# Altium schematic sheet PF3_MS.SchDoc
size 279 x 177 mm
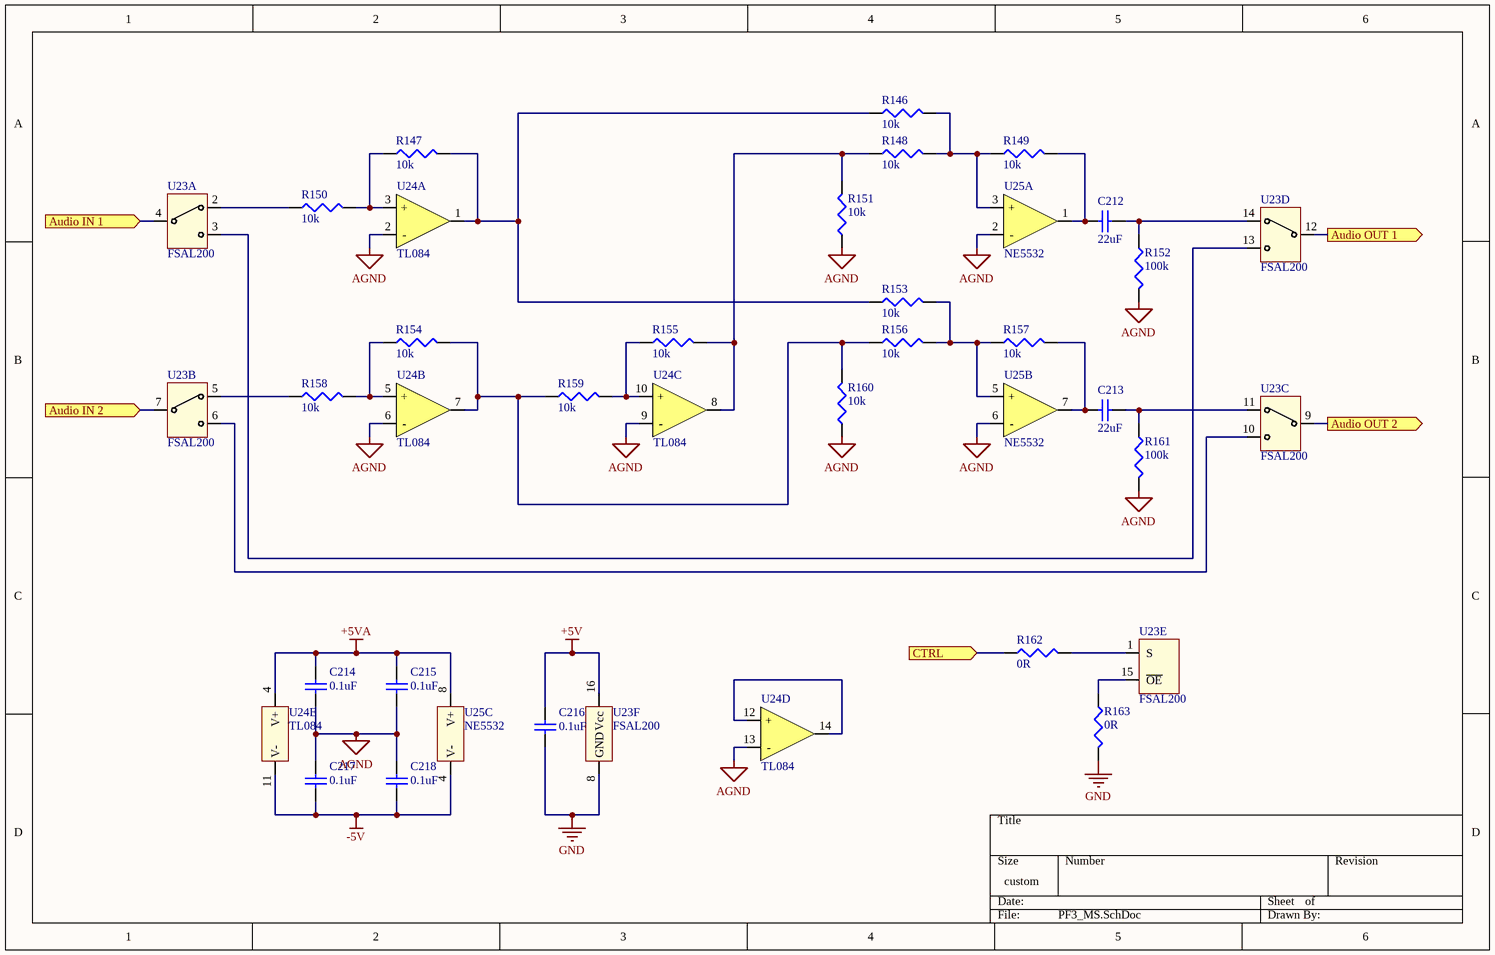
[diagram p0: PF3_MS.SchDoc]

## Parts
C212  22uF  [CAPC1608X08]
C213  22uF  [CAPC1608X08]
C214  0.1uF  [CAPC1608X08]
C215  0.1uF  [CAPC1608X08]
C216  0.1uF  [CAPC1608X08]
C217  0.1uF  [CAPC1608X08]
C218  0.1uF  [CAPC1608X08]
R146  10k  [RESC1608X05]
R147  10k  [RESC1608X05]
R148  10k  [RESC1608X05]
R149  10k  [RESC1608X05]
R150  10k  [RESC1608X05]
R151  10k  [RESC1608X05]
R152  100k  [RESC1608X05]
R153  10k  [RESC1608X05]
R154  10k  [RESC1608X05]
R155  10k  [RESC1608X05]
R156  10k  [RESC1608X05]
R157  10k  [RESC1608X05]
R158  10k  [RESC1608X05]
R159  10k  [RESC1608X05]
R160  10k  [RESC1608X05]
R161  100k  [RESC1608X05]
R162  0R  [RESC1608X05]
R163  0R  [RESC1608X05]
U23  FSAL200  [TSOP65P730X110-16N]  (parts A,B,C,D,E,F of 6)
U24  TL084  [D14-M]  (parts A,B,C,D,E of 5)
U25  NE5532  [D8-M]  (parts A,B,C of 3)

## Ports
Audio IN 1 (in), Audio IN 2 (in), Audio OUT 1 (out), Audio OUT 2 (out), CTRL (in)

## Nets
+5V: C216.1 U23.16(Vcc)
+5VA: C214.1 C215.1 U24.4(V+) U25.8(V+)
-5V: C217.2 C218.2 U24.11(V-) U25.4(V-)
AGND: C214.2 C215.2 C217.1 C218.1 R151.1 R152.2 R160.1 R161.2 U24.2(-) U24.6(-) U24.9(-) U24.13(-) U25.2(-) U25.6(-)
GND: C216.2 R163.2 U23.8(GND)
Audio IN 1: U23.4(A) ; port Audio IN 1
Audio IN 2: U23.7(A) ; port Audio IN 2
Audio OUT 1: U23.12(A) ; port Audio OUT 1
Audio OUT 2: U23.9(A) ; port Audio OUT 2
CTRL: R162.1 ; port CTRL
NetC212_1: C212.1 R152.1 U23.14(B1)
NetC212_2: C212.2 R149.2 U25.1(OUT)
NetC213_1: C213.1 R161.1 U23.11(B1)
NetC213_2: C213.2 R157.2 U25.7(OUT)
NetR146_1: R146.1 R147.2 R153.1 U24.1(OUT)
NetR146_2: R146.2 R148.2 R149.1 U25.3(+)
NetR147_1: R147.1 R150.2 U24.3(+)
NetR148_1: R148.1 R151.2 R155.2 U24.8(OUT)
NetR150_1: R150.1 U23.2(B1)
NetR153_2: R153.2 R156.2 R157.1 U25.5(+)
NetR154_1: R154.1 R158.2 U24.5(+)
NetR154_2: R154.2 R156.1 R159.1 R160.2 U24.7(OUT)
NetR155_1: R155.1 R159.2 U24.10(+)
NetR158_1: R158.1 U23.5(B1)
NetR162_2: R162.2 U23.1(S)
NetR163_1: R163.1 U23.15(~{OE})
NetU23_3: U23.3(B2) U23.13(B2)
NetU23_6: U23.6(B2) U23.10(B2)
NetU24_12: U24.12(+) U24.14(OUT)

## Library data of the parts
C212 C213 = Cap Semi: Capacitor (Semiconductor SIM Model); Fabricant: MURATA; Fournisseur: Farnell; RefFabricant: GRM188R60J226MEA0D; RefFournisseur: 2666490; Value: 22uF; Case: 0603 [1608 Metric]; DataSheet: http://www.farnell.com/datasheets/1955681.pdf
C214-C218 = Cap Semi: Capacitor (Semiconductor SIM Model); Fabricant: MURATA; Fournisseur: Farnell; RefFabricant: GRM188F51E104ZA01D; RefFournisseur: 2821272; Value: 0.1uF; Case: 0603 [1608 Metric]; DataSheet: http://www.farnell.com/datasheets/2048672.pdf
R146-R151 R153-R160 = Res3: Resistor; Fabricant: TE CONNECTIVITY; Fournisseur: Farnell; RefFabricant: CPF-A-0603B4K7E1; RefFournisseur: 2483933; Value: 10k; Case: 0603 [1608 Metric]; DataSheet: http://www.farnell.com/datasheets/1935020.pdf
R152 R161 = Res3: Resistor; Fabricant: TE CONNECTIVITY; Fournisseur: Farnell; RefFabricant: RN73C1J100KBTDF; RefFournisseur: 2687850; Value: 100k; Case: 0603 [1608 Metric]; DataSheet: http://www.farnell.com/datasheets/2189072.pdf
R162 R163 = Res3: Resistor; Value: 0; Case: 0603 [1608 Metric]
U23 = FSAL200: Quad 2:1 Multiplexer; Fabricant: ON SEMICONDUCTOR; Fournisseur: Farnell; RefFabricant: FSAL200QSCX; RefFournisseur: 2450768; DataSheet: http://www.farnell.com/datasheets/2299862.pdf
U24 = TL084: Quad Audio OpAmp; Fabricant: TEXAS INSTRUMENTS; RefFournisseur: 9593462; RefFabricant: TL084ID; Fournisseur: Farnell; DataSheet: http://www.ti.com/lit/ds/symlink/tl084.pdf
U25 = NE5532: Dual Audio OpAmp; Fournisseur: Farnell; RefFournisseur: 1103060; Fabricant: TEXAS INSTRUMENTS; RefFabricant: NE5532; DataSheet: http://www.ti.com/lit/ds/symlink/ne5532a.pdf